# EAGLE board module_special_reg_ctrl (EAGLE 6.5.0)
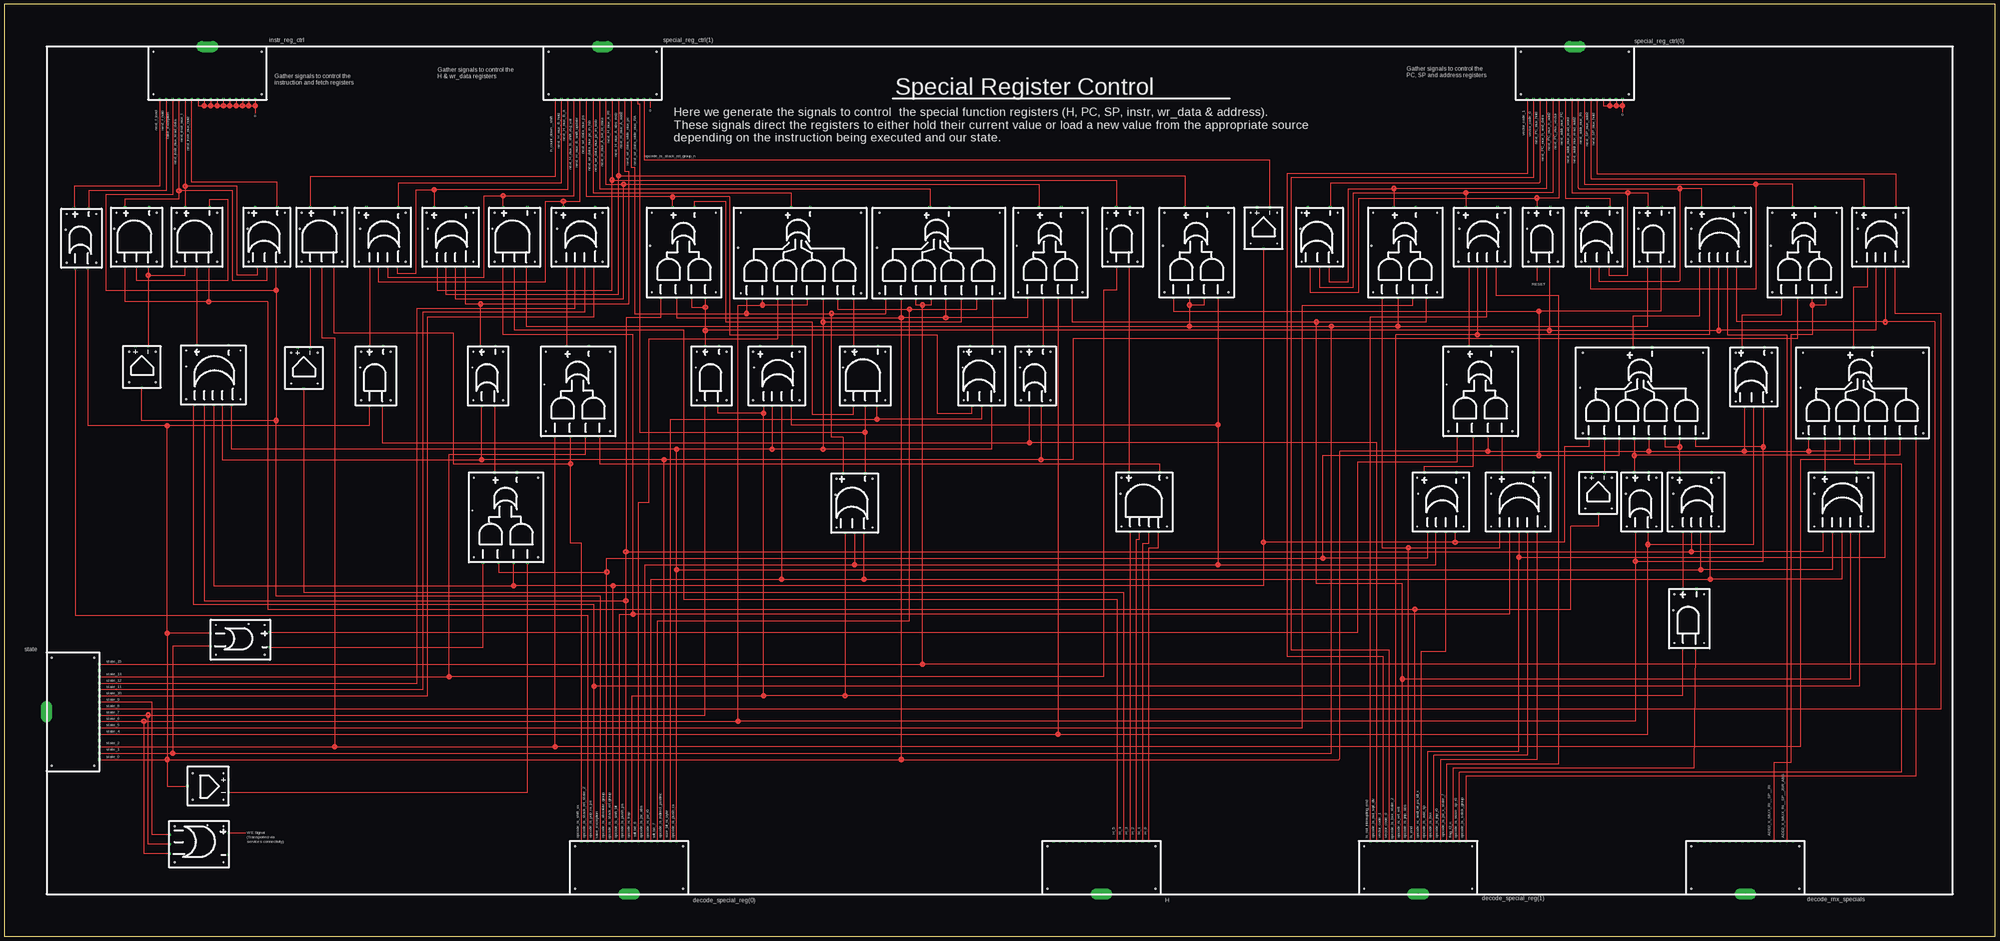
[diagram p12: board, top side]

Size 1193.8 x 558.8 mm. Coordinates in mm from the lower left corner, seen from the top.
Outline: 0,0 1193.8,0 1193.8,558.8 0,558.8 0,0
Copper layers (1*16): Top 0.035mm / dielectric 1.5mm / Bottom 0.035mm
Design rules "default": minimum track width 10mil, minimum drill 24mil, track to track 8mil, track to pad 8mil, pad to pad 8mil, via to via 8mil, smd to smd 8mil, copper to edge 40mil, drill to drill 8mil, minimum pad ring 10mil, minimum via ring 8mil, stop-mask expansion 4mil, vias tented up to drill 0mil, thermal gap 10mil
tKeepout: area 16.3,16.3 to 34.5,34.5; area 587.8,524.3 to 606,542.5; area 1159.3,524.3 to 1177.5,542.5; area 587.8,16.3 to 606,34.5; area 1159.3,16.3 to 1177.5,34.5; area 16.3,524.3 to 34.5,542.5

## Footprints (pad centres in the part's own frame; a part is rotated, then mirrored left to right if it is on the bottom)
3OR = drill 0.8 square: OUT_M 16.51,-6.985; OUT_P 16.51,6.35; P$1 -19.05,-6.35; P$2 -19.05,-0.635; P$3 -19.05,5.08 | hole 0.6: -15.875,-11.43; 13.335,-11.43; 13.335,10.16; -15.875,10.16; 3.81,10.795
2OR = drill 0.8 square: OUT_M 17.78,-4.445; OUT_P 17.78,4.445; P$1 -17.78,-3.81; P$2 -17.78,3.81 | hole 0.6: -14.605,8.89; 14.605,-8.89; 14.605,8.89; -14.605,-8.89; 5.08,9.525
BUS_SPLIT_DISPLAY = drill 0.8 pad 6.452 long: INPUT 0,15.24 | drill 0.8 square: P$1 -28.575,-16.51; P$2 -24.765,-16.51; P$3 -20.955,-16.51; P$4 -17.145,-16.51; P$5 -13.335,-16.51; P$6 -9.525,-16.51; P$7 -5.715,-16.51; P$8 -1.905,-16.51; P$9 1.905,-16.51; P$10 5.715,-16.51; P$11 9.525,-16.51; P$12 13.335,-16.51; P$13 17.145,-16.51; P$14 20.955,-16.51; P$15 24.765,-16.51; P$16 28.575,-16.51 | hole 0.6: -32.385,-13.335; -32.385,12.065; 32.385,12.065; 32.385,-13.335
1BUF = drill 0.8 square: IN -12.7,0; N 12.065,-3.81; P 12.065,3.81 | hole 0.6: -9.525,7.62; -9.525,-8.255; 8.89,-8.255; 8.89,7.62
4OR = drill 0.8 square: 1 -16.51,-8.255; 2 -16.51,-2.54; 3 -16.51,3.175; 4 -16.51,8.255; OUT_M 19.05,-8.89; OUT_P 19.05,10.16 | hole 0.6: -13.335,-13.335; 15.875,-13.335; 15.875,14.605; -13.335,14.605; 6.35,13.97
4X2AND_OR = drill 0.8 square: OUT_M 26.67,-6.985; OUT_P 26.67,4.445; P$1 -27.94,-33.02; P$2 -27.94,-23.495; P$3 -27.94,-14.605; P$4 -27.94,-5.08; P$5 -27.94,3.81; P$6 -27.94,12.7; P$7 -27.94,21.59; P$8 -27.94,31.115 | hole 0.6: -24.765,-37.465; 23.495,-37.465; 23.495,34.608; -24.765,34.608; 2.54,36.195
5OR = drill 0.8 square: 1 -17.78,-10.795; 2 -17.78,-5.08; 3 -17.78,0; 4 -17.78,5.715; 5 -17.78,11.43; OUT_M 17.78,-8.89; OUT_P 17.78,10.16 | hole 0.6: -14.605,-15.875; 14.605,-15.875; 14.605,16.51; -14.605,16.51; 5.08,16.51
3AND = drill 0.8 square: OUT_M 16.51,-7.62; OUT_P 16.51,6.985; P$1 -19.05,-6.985; P$2 -19.05,0; P$3 -19.05,6.985 | hole 0.6: -15.875,-12.065; 13.335,-12.065; 13.335,12.065; -15.875,12.065; 3.81,13.335
2AND = drill 0.8 square: OUT_M 19.05,-4.445; OUT_P 19.05,3.81; P$1 -16.51,-3.81; P$2 -16.51,3.81 | hole 0.6: -13.335,8.89; 15.875,-8.89; -13.335,-8.89; 15.875,8.89; 6.35,9.525
2X2AND_OR = drill 0.8 square: OUT_M 27.94,-6.985; OUT_P 27.94,6.35; P$1 -26.035,-13.335; P$2 -26.035,-5.08; P$3 -26.035,3.81; P$4 -26.035,13.335 | hole 0.6: -22.86,18.733; 24.765,18.733; -22.86,-19.685; 24.765,-19.685; 5.08,19.685
4AND = drill 0.8 square: OUT_M 17.145,-8.89; OUT_P 17.145,9.525; P$1 -18.415,-8.255; P$2 -18.415,-2.54; P$3 -18.415,3.175; P$4 -18.415,8.89 | hole 0.6: -15.24,-13.335; 13.97,-13.335; 13.97,13.97; -15.24,13.97; 4.445,14.605

## Placement (x,y rotation side)
CMP1  3OR  [3OR]  955.67,420.37 90 top
CMP2  2OR  [2OR]  618.49,335.92 90 top
CMP3  BUS_CONSTRUCT_DISPLAY  [BUS_SPLIT_DISPLAY]  358.77,518.16 0 top
CMP4  1BUF  [1BUF]  122.56,90.17 0 top
CMP5  4OR  [4OR]  861.7,259.08 90 top
CMP6  1BUF  [1BUF]  179.71,341 90 top
CMP7  1BUF  [1BUF]  755.01,424.81 90 top
CMP8  2OR  [2OR]  290.19,335.92 90 top
CMP9  4OR  [4OR]  1014.73,259.08 90 top
CMP10  4X2AND_OR  [4X2AND_OR]  981.08,326.39 90 top
CMP11  5OR  [5OR]  1028.07,419.1 90 top
CMP12  2OR  [2OR]  141.6,177.8 0 top
CMP13  BUS_SPLIT_DISPLAY  [BUS_SPLIT_DISPLAY]  1043.94,40.64 180 top
CMP14  3OR  [3OR]  509.27,260.99 90 top
CMP15  3AND  [3AND]  190.5,420.37 90 top
CMP16  2AND  [2AND]  989.33,417.83 90 top
CMP17  2X2AND_OR  [2X2AND_OR]  407.04,408.94 90 top
CMP18  BUS_SPLIT_DISPLAY  [BUS_SPLIT_DISPLAY]  40.64,134.62 90 top
CMP19  BUS_SPLIT_DISPLAY  [BUS_SPLIT_DISPLAY]  657.86,40.64 180 top
CMP20  2X2AND_OR  [2X2AND_OR]  1078.87,408.94 90 top
CMP21  3AND  [3AND]  516.25,337.19 90 top
CMP22  1BUF  [1BUF]  955.67,266.06 90 top
CMP23  BUS_SPLIT_DISPLAY  [BUS_SPLIT_DISPLAY]  847.73,40.64 180 top
CMP24  BUS_SPLIT_DISPLAY  [BUS_SPLIT_DISPLAY]  374.65,40.64 180 top
CMP25  4OR  [4OR]  463.55,334.64 90 top
CMP26  4X2AND_OR  [4X2AND_OR]  476.25,410.21 90 top
CMP27  3OR  [3OR]  585.47,337.19 90 top
CMP28  4X2AND_OR  [4X2AND_OR]  559.43,410.21 90 top
CMP29  5OR  [5OR]  908.05,260.35 90 top
CMP30  4OR  [4OR]  886.46,417.83 90 top
CMP31  BUS_CONSTRUCT_DISPLAY  [BUS_SPLIT_DISPLAY]  121.92,518.16 0 top
CMP32  4AND  [4AND]  683.89,260.99 90 top
CMP33  2AND  [2AND]  670.56,417.83 90 top
CMP34  2X2AND_OR  [2X2AND_OR]  714.38,408.94 90 top
CMP35  3AND  [3AND]  306.07,420.37 90 top
CMP36  3OR  [3OR]  1048.38,336.55 90 top
CMP37  2X2AND_OR  [2X2AND_OR]  626.75,408.94 90 top
CMP38  4OR  [4OR]  267.97,417.83 90 top
CMP39  2X2AND_OR  [2X2AND_OR]  343.54,325.75 90 top
CMP40  4OR  [4OR]  345.44,417.83 90 top
CMP41  5OR  [5OR]  1101.72,260.35 90 top
CMP42  4X2AND_OR  [4X2AND_OR]  1113.15,326.39 90 top
CMP43  2OR  [2OR]  981.71,260.35 90 top
CMP44  2X2AND_OR  [2X2AND_OR]  884.55,325.75 90 top
CMP45  2AND  [2AND]  424.18,334.64 90 top
CMP46  2X2AND_OR  [2X2AND_OR]  300.36,250.19 90 top
CMP47  4OR  [4OR]  1125.22,417.83 90 top
CMP48  2AND  [2AND]  222.88,334.64 90 top
CMP49  4OR  [4OR]  227.33,417.83 90 top
CMP50  3OR  [3OR]  118.11,55.88 0 top
CMP52  2X2AND_OR  [2X2AND_OR]  839.47,408.94 90 top
CMP53  2AND  [2AND]  922.65,417.83 90 top
CMP54  3OR  [3OR]  788.03,420.37 90 top
CMP56  BUS_CONSTRUCT_DISPLAY  [BUS_SPLIT_DISPLAY]  941.71,518.16 0 top
CMP57  2OR  [2OR]  46.35,418.46 90 top
CMP58  5OR  [5OR]  125.73,336.55 90 top
CMP59  3AND  [3AND]  115.57,420.37 90 top
CMP60  3AND  [3AND]  79.38,420.37 90 top
CMP61  3OR  [3OR]  156.84,420.37 90 top
CMP62  1BUF  [1BUF]  82.55,341.63 90 top
CMP67  2AND  [2AND]  1010.28,189.23 90 top

## Tracks (layer width: path | path; a pad name or v marks a point on that pad's centre or on a via)
ADD2_X_MUX_RI__SP__JSR_ABS
  Top 0.61: CMP11.2 1033.14,360.68 1068.7,360.68 CMP13.P$2
FLAG_F2_N
  Top 0.61: CMP67.P$1 1013.46,100.97 868.68,100.97 CMP23.P$3
H_0
  Top 0.61: CMP19.P$1 686.43,233.04 692.15,233.04 CMP32.P$1
H_1
  Top 0.61: CMP19.P$2 682.62,235.59 686.43,235.59 CMP32.P$2
H_2
  Top 0.61: CMP19.P$3 678.82,238.12 680.72,238.12 CMP32.P$3
H_3
  Top 0.61: CMP32.P$4 CMP19.P$4
H_4
  Top 0.61: CMP6.IN 179.71,206.38 671.2,206.38 CMP19.P$5
H_4_N
  Top 0.61: CMP15.P$3 CMP6.N
H_5
  Top 0.61: CMP19.P$6 667.38,201.93 407.67,201.93 407.67,363.22 306.07,363.22 CMP35.P$2
H_COUNT_DOWN_SHIFT
  Top 0.61: CMP3.P$1 330.2,455.3 183.51,455.3 CMP15.OUT_P
H_COUNT_IS_15
  Top 0.61: CMP33.P$1 CMP32.OUT_P
H_COUNT_IS_15_N
  Top 0.61: CMP39.P$1 356.87,283.21 692.78,283.21 CMP32.OUT_M
IS_END
  Top 0.61: 122.56,380.37 158.12,380.37 158.12,196.22 845.82,196.22 | 122.56,380.37 72.39,380.37 CMP60.P$3 | CMP22.IN 955.67,245.75 939.16,245.75 939.16,196.22 845.82,196.22 | CMP59.P$1 122.56,380.37 | CMP23.P$9 845.82,196.22
IS_END_N
  Top 0.61: CMP10.P$7 CMP22.N
IS_NOT_INTERRUPTING_END
  Top 0.61: CMP23.P$16 819.15,371.48 889,371.48 CMP30.2
IS_STATE_0_1
  Top 0.61: CMP12.OUT_P 811.53,182.25 811.53,284.48 871.22,284.48 CMP44.P$4
IS_STATE_0_1_N
  Top 0.61: CMP12.OUT_M 287.02,173.35 CMP46.P$4
IS_STATE_0_4_6
  Top 0.61: CMP36.OUT_P 1042.04,372.75 1065.53,372.75 CMP20.P$4
IS_STATE_4_6
  Top 0.61: CMP10.P$5 977.26,288.29 | 977.26,288.29 CMP43.OUT_P | CMP42.P$2 1136.65,288.29 977.26,288.29
N$1
  Top 0.61: CMP56.P$13 958.85,497.84 962.66,497.84 | 962.66,497.84 966.47,497.84 | 966.47,497.84 970.28,497.84 | 970.28,497.84 970.28,494.03 | CMP56.P$16 970.28,497.84 | CMP56.P$15 966.47,497.84 | CMP56.P$14 962.66,497.84
N$4
  Top 0.61: CMP31.P$16 150.5,497.84 | 150.5,497.84 150.5,493.39 | CMP31.P$7 116.2,497.84 120.02,497.84 | 120.02,497.84 123.83,497.84 | 123.83,497.84 127.64,497.84 | 127.64,497.84 131.44,497.84 | 131.44,497.84 135.25,497.84 | 135.25,497.84 139.06,497.84 | 139.06,497.84 142.88,497.84 | 142.88,497.84 146.69,497.84 | 146.69,497.84 150.5,497.84 | CMP31.P$8 120.02,497.84 | CMP31.P$9 123.83,497.84 | CMP31.P$10 127.64,497.84 | CMP31.P$11 131.44,497.84 | CMP31.P$12 135.25,497.84 | CMP31.P$13 139.06,497.84 | CMP31.P$14 142.88,497.84 | CMP31.P$15 146.69,497.84
N$5
  Top 0.61: 387.35,500.38 387.35,496.57
NEXT_ADDR_MUX_ADD2
  Top 0.61: CMP11.OUT_P 1017.9,448.31 1004.57,448.31 | 1004.57,448.31 1004.57,393.06 1003.93,392.43 956.31,392.43 CMP1.P$2 | CMP56.P$9 943.61,448.94 944.25,448.31 1004.57,448.31
NEXT_ADDR_MUX_ADD2__SET_A
  Top 0.61: CMP10.OUT_P 976.63,372.11 1016.63,372.11 CMP11.5
NEXT_ADDR_MUX_ADD2__SET_A_OPTIONS
  Top 0.61: CMP10.P$3 995.68,293.37 1004.57,293.37 | 1004.57,293.37 CMP10.P$2 | CMP9.OUT_P 1004.57,293.37
NEXT_ADDR_MUX_PC
  Top 0.61: CMP56.P$7 935.99,442.6 962.66,442.6 CMP1.OUT_M
NEXT_ADDR_MUX_READ_WORD
  Top 0.61: CMP56.P$8 939.8,445.77 973.46,445.77 | 973.46,445.77 985.52,445.77 CMP16.OUT_P | CMP1.P$1 962.02,396.24 973.46,396.24 973.46,445.77
NEXT_ADDR_MUX_RI
  Top 0.61: CMP20.OUT_P 1072.52,450.85 1050.29,450.85 | 1050.29,450.85 1050.29,387.99 951.23,387.99 951.23,400.69 CMP1.P$3 | CMP56.P$10 947.42,450.85 1050.29,450.85
NEXT_ADDR_MUX_RI__SP
  Top 0.61: CMP20.P$1 1092.2,378.46 1083.94,378.46 | 1083.94,378.46 CMP20.P$2 | 1083.94,378.46 1083.94,360.68 1071.24,360.68 1071.24,104.14 1061.09,104.14 CMP13.P$4
NEXT_F_HOLD
  Top 0.61: CMP31.P$2 97.16,447.04 50.8,447.04 CMP57.OUT_M
NEXT_F_LOAD
  Top 0.61: CMP31.P$1 93.34,449.58 41.91,449.58 CMP57.OUT_P
NEXT_H_MUX_A_ABS_MSB
  Top 0.61: CMP3.P$11 368.3,455.93 | 368.3,455.93 708.02,455.93 CMP34.OUT_P | CMP38.3 264.8,384.81 368.3,384.81 368.3,455.93
NEXT_H_MUX_A_ADD2
  Top 0.61: CMP3.P$12 372.11,458.47 374.65,458.47 374.65,379.1 285.75,379.1 | CMP38.1 276.23,379.1 285.75,379.1 | CMP8.OUT_P 285.75,379.1
NEXT_H_MUX_A_ADD2__SET_A
  Top 0.61: CMP8.P$1 CMP46.OUT_P
NEXT_H_MUX_A_R1
  Top 0.61: CMP3.P$10 364.49,453.39 | 364.49,453.39 666.75,453.39 CMP33.OUT_P | CMP38.4 259.71,387.35 364.49,387.35 364.49,453.39
NEXT_H_MUX_A_SXT_RD_DATA
  Top 0.61: CMP3.P$9 360.68,450.85 371.48,450.85 | 371.48,450.85 620.39,450.85 CMP37.OUT_P | CMP38.2 270.51,382.27 371.48,382.27 371.48,450.85
NEXT_H_MUX_A_SXT_RD_DATA__EXCL_N
  Top 0.61: CMP37.P$3 CMP2.OUT_M
NEXT_H_MUX_B_A
  Top 0.61: CMP3.P$3 337.82,447.68 257.81,447.68 | 257.81,447.68 CMP38.OUT_P | CMP49.1 235.59,397.51 247.01,397.51 247.01,447.68 257.81,447.68
NEXT_H_MUX_B_CLEAR
  Top 0.61: CMP49.4 CMP48.OUT_P
NEXT_H_MUX_B_HOLD
  Top 0.61: CMP3.P$2 334.01,451.49 236.22,451.49 CMP49.OUT_M
NEXT_H_MUX_B_SHIFT_REG_VAL
  Top 0.61: CMP35.OUT_P 299.08,443.87 | 299.08,443.87 341.63,443.87 CMP3.P$4 | CMP49.2 229.87,394.97 287.65,394.97 287.65,443.87 299.08,443.87
NEXT_H_MUX_B_SHIFT_UPDATE
  Top 0.61: CMP40.OUT_P 335.28,440.69 | 335.28,440.69 345.44,440.69 CMP3.P$5 | CMP49.3 224.16,392.43 324.49,392.43 324.49,440.69 335.28,440.69
NEXT_H_MUX_B_SHIFT_UPDATE__SET_A
  Top 0.61: CMP40.4 CMP39.OUT_P
NEXT_INSTR_MUX_F
  Top 0.61: CMP31.P$5 108.58,449.58 | 108.58,449.58 CMP59.OUT_P | CMP61.P$3 151.76,396.24 139.7,396.24 139.7,449.58 108.58,449.58
NEXT_INSTR_MUX_F__OPTIONS
  Top 0.61: CMP59.P$2 CMP58.OUT_P
NEXT_INSTR_MUX_F_N
  Top 0.61: CMP59.OUT_M 123.19,441.96 133.99,441.96 133.99,393.06 79.38,393.06 CMP60.P$2
NEXT_INSTR_MUX_HOLD
  Top 0.61: CMP61.OUT_M 163.83,452.12 112.39,452.12 CMP31.P$6
NEXT_INSTR_MUX_READ_DATA
  Top 0.61: CMP31.P$4 104.78,447.04 | 104.78,447.04 104.78,441.96 72.39,441.96 CMP60.OUT_P | CMP61.P$2 157.48,393.06 137.16,393.06 137.16,447.04 104.78,447.04
NEXT_PC_MUX_ADD2
  Top 0.61: CMP56.P$5 928.37,445.77 876.3,445.77 | 876.3,445.77 CMP30.OUT_P | CMP54.P$2 788.67,389.25 808.99,389.25 808.99,445.77 876.3,445.77
NEXT_PC_MUX_ADD2__0_OPTIONS
  Top 0.61: CMP44.P$1 CMP29.OUT_P
NEXT_PC_MUX_ADD2__MEM_OPTIONS
  Top 0.61: CMP5.OUT_P 851.53,281.94 880.75,281.94 CMP44.P$3
NEXT_PC_MUX_ADD2__SET_A
  Top 0.61: CMP30.4 CMP44.OUT_P
NEXT_PC_MUX_H_AND_DATA
  Top 0.61: CMP56.P$4 924.56,448.31 833.12,448.31 | 833.12,448.31 CMP52.OUT_P | CMP54.P$1 794.38,392.43 805.82,392.43 805.82,448.31 833.12,448.31
NEXT_PC_MUX_HOLD
  Top 0.61: CMP56.P$3 920.75,452.12 920.12,451.49 795.02,451.49 CMP54.OUT_M
NEXT_PC_MUX_VECTOR
  Top 0.61: CMP56.P$6 932.18,442.6 918.85,442.6 | 918.85,442.6 CMP53.OUT_P | CMP54.P$3 782.96,386.08 812.16,386.08 812.16,442.6 918.85,442.6
NEXT_SP_ADD2__B
  Top 0.61: CMP47.4 1116.96,389.25 1108.71,389.25 CMP42.OUT_P
NEXT_SP_MUX_ADD2
  Top 0.61: CMP56.P$11 951.23,454.02 1115.06,454.02 CMP47.OUT_P
NEXT_SP_MUX_ADD2__SET_A_OPTIONS
  Top 0.61: CMP42.P$7 CMP41.OUT_P
NEXT_SP_MUX_HOLD
  Top 0.61: CMP56.P$12 955.04,457.2 1134.11,457.2 CMP47.OUT_M
NEXT_WR_DATA_MUX_PC_RA_LSB__7
  Top 0.61: CMP26.P$1 CMP21.OUT_P
NEXT_WR_DATA_MUX_PC_RA_MSB__7
  Top 0.61: CMP28.P$1 CMP27.OUT_M
NEXT_WR_DATA_MUX_PC_RN_LSB
  Top 0.61: CMP3.P$7 353.06,445.77 471.81,445.77 CMP26.OUT_P
NEXT_WR_DATA_MUX_PC_RN_MSB
  Top 0.61: CMP3.P$8 356.87,448.31 554.99,448.31 CMP28.OUT_P
NEXT_WR_DATA_MUX_PS
  Top 0.61: 400.69,443.23 434.98,443.23 434.98,360.68 559.43,360.68 559.43,313.69 580.39,313.69 CMP27.P$3 | 400.69,443.23 349.25,443.23 CMP3.P$6 | CMP17.OUT_P 400.69,443.23
NEXT_WR_DATA_MUX_PS_N
  Top 0.61: CMP17.OUT_M 414.02,440.69 432.44,440.69 432.44,368.3 484.5,368.3 484.5,313.06 509.27,313.06 CMP21.P$3
NON_RESET_TRAP
  Top 0.61: CMP9.4 CMP67.OUT_P
OPCODE_IS_ABSOLUTE_GROUP
  Top 0.61: CMP16.P$1 993.14,374.65 920.12,374.65 | 920.12,374.65 920.12,288.29 | 920.12,288.29 968.38,288.29 CMP10.P$6 | CMP34.P$4 701.04,374.65 920.12,374.65 | CMP5.4 853.44,226.69 790.58,226.69 | 790.58,226.69 790.58,288.29 920.12,288.29 | CMP46.P$3 296.55,218.44 361.31,218.44 | 790.58,226.69 361.31,226.69 361.31,218.44 | CMP24.P$12 361.31,218.44
OPCODE_IS_ADD_SP
  Top 0.61: CMP29.3 908.05,227.33 | 908.05,227.33 1127.76,227.33 CMP42.P$3 | 908.05,227.33 908.05,111.12 853.44,111.12 CMP23.P$7
OPCODE_IS_ANDI_ORI_PS_LDI_X
  Top 0.61: CMP5.2 864.24,170.81 849.63,170.81 CMP23.P$8
OPCODE_IS_BXX
  Top 0.61: CMP29.2 913.13,108.58 857.25,108.58 CMP23.P$6
OPCODE_IS_BXX_STATE_2
  Top 0.61: CMP30.3 883.28,360.68 | 883.28,360.68 834.39,360.68 CMP23.P$12 | CMP11.4 1022.35,360.68 883.28,360.68
OPCODE_IS_INDIRECT_POSTINC
  Top 0.61: CMP58.2 130.81,285.75 286.38,285.75 | 286.38,285.75 CMP8.P$2 | CMP20.P$3 1075.06,358.14 640.72,358.14 640.72,285.75 621.66,285.75 | CMP2.P$1 621.66,317.5 621.66,285.75 | 621.66,285.75 395.61,285.75 | 395.61,285.75 286.38,285.75 | CMP24.P$3 395.61,285.75
OPCODE_IS_JMP_ABS
  Top 0.61: CMP52.P$4 826.13,233.04 842.01,233.04 | 842.01,233.04 896.62,233.04 CMP29.5 | CMP23.P$10 842.01,233.04
OPCODE_IS_JMP_R0
  Top 0.61: CMP29.1 918.85,106.05 861.06,106.05 CMP23.P$5
OPCODE_IS_JSR_ABS
  Top 0.61: CMP34.P$1 727.71,306.7 | 727.71,306.7 727.71,222.88 | 727.71,222.88 858.52,222.88 CMP5.3 | CMP25.1 471.81,306.7 727.71,306.7 | CMP14.P$2 509.9,222.88 | 509.9,222.88 727.71,222.88 | CMP24.P$6 384.18,222.88 509.9,222.88
OPCODE_IS_JSR_R0
  Top 0.61: CMP41.3 1101.72,214 1022.99,214 | 1022.99,214 CMP9.1 | CMP25.2 466.09,214 | 466.09,214 515.62,214 | 515.62,214 CMP14.P$1 | 515.62,214 1022.99,214 | CMP24.P$5 387.99,214 466.09,214
OPCODE_IS_JSR_X_STATE_7
  Top 0.61: CMP30.1 894.72,384.18 932.18,384.18 932.18,103.5 864.87,103.5 CMP23.P$4
OPCODE_IS_MOVE_SP_R0
  Top 0.61: CMP42.P$5 1109.35,283.21 1137.29,283.21 1137.29,98.42 872.49,98.42 CMP23.P$2
OPCODE_IS_MUL_SQRT_DIV
  Top 0.61: 614.68,295.91 822.96,295.91 CMP23.P$15 | 614.68,295.91 CMP2.P$2 | CMP48.P$1 226.69,295.91 614.68,295.91
OPCODE_IS_POP_RA_PS
  Top 0.61: CMP24.P$14 353.69,149.86 | 353.69,149.86 353.69,198.75 113.67,198.75 113.67,318.13 CMP58.5 | CMP41.1 1112.52,149.86 353.69,149.86
OPCODE_IS_PUSH_PS
  Top 0.61: CMP17.P$4 393.7,370.84 372.75,370.84 372.75,230.5 | CMP41.5 1090.3,230.5 1011.55,230.5 | CMP9.3 1011.55,230.5 | 372.75,230.5 1011.55,230.5 | CMP24.P$9 372.75,201.29 | 372.75,201.29 372.75,230.5 | CMP58.4 120.02,201.29 372.75,201.29
OPCODE_IS_PUSH_RA
  Top 0.61: CMP25.3 460.38,292.1 | 460.38,292.1 403.23,292.1 | 403.23,292.1 136.53,292.1 CMP58.1 | CMP26.P$3 490.86,368.3 | 490.86,368.3 574.04,368.3 CMP28.P$3 | CMP41.4 1096.01,219.71 1017.27,219.71 | 1017.27,219.71 CMP9.2 | 490.86,368.3 490.86,292.1 | 490.86,292.1 460.38,292.1 | CMP27.P$1 591.82,292.1 490.86,292.1 | 403.23,219.71 1017.27,219.71 | CMP24.P$1 403.23,219.71 | 403.23,219.71 403.23,292.1
OPCODE_IS_RET_RETI
  Top 0.61: CMP37.P$1 640.08,368.3 786.76,368.3 | 786.76,368.3 852.8,368.3 CMP52.P$1 | 786.76,368.3 786.76,211.46 838.2,211.46 838.2,154.31 | CMP23.P$11 838.2,154.31 | CMP41.2 1106.81,154.31 838.2,154.31
OPCODE_IS_SHIFT_BIT
  Top 0.61: CMP29.4 902.34,193.04 377.19,193.04 | 377.19,193.04 377.19,360.68 299.08,360.68 CMP35.P$3 | CMP24.P$10 368.94,193.04 377.19,193.04
OPCODE_IS_SHIFT_XX
  Top 0.61: CMP15.P$1 197.49,361.95 269.24,361.95 269.24,283.21 339.73,283.21 | 339.73,283.21 CMP39.P$3 | CMP24.P$16 346.07,235.59 339.73,235.59 339.73,283.21
OPCODE_IS_STACK_GROUP
  Top 0.61: CMP42.P$1 1146.17,95.89 876.3,95.89 CMP23.P$1
OPCODE_IS_STACK_REL_GROUP
  Top 0.61: CMP10.P$8 949.96,293.37 935.36,293.37 935.36,236.22 869.95,236.22 | 869.95,236.22 CMP5.1 | CMP7.IN 755.01,236.22 | 755.01,236.22 755.01,210.19 365.12,210.19 | 365.12,210.19 305.44,210.19 | 305.44,210.19 CMP46.P$2 | CMP58.3 125.73,210.19 305.44,210.19 | CMP24.P$11 365.12,210.19 | 869.95,236.22 755.01,236.22
OPCODE_IS_STACK_REL_GROUP_N
  Top 0.61: CMP7.N 758.83,465.45 383.54,465.45 CMP3.P$15
OPCODE_IS_STACK_REL_STATE_2
  Top 0.61: CMP57.P$2 42.55,192.41 349.88,192.41 CMP24.P$15
OPCODE_IS_TRAP
  Top 0.61: CMP25.4 455.3,313.69 | 455.3,313.69 427.99,313.69 CMP45.P$1 | CMP14.P$3 504.19,144.15 | 504.19,144.15 455.3,144.15 | 455.3,144.15 455.3,313.69 | CMP67.P$2 1006.48,144.15 504.19,144.15 | CMP24.P$8 376.56,144.15 455.3,144.15
OPCODE_IS_TRAP_JSR_X
  Top 0.61: CMP28.P$8 528.32,373.38 495.94,373.38 | CMP14.OUT_P 502.92,299.08 495.94,299.08 495.94,373.38 | CMP26.P$8 445.13,373.38 | 445.13,373.38 495.94,373.38 | CMP3.P$13 375.92,461.01 377.82,461.01 377.82,373.38 445.13,373.38
OPCODE_IS_TRAP_JSR_X_N
  Top 0.61: CMP21.P$2 516.25,302.26 | 516.25,302.26 CMP14.OUT_M | CMP3.P$14 379.73,499.11 381,499.11 381,302.26 516.25,302.26
OPCODE_IS_TRAP_JSR_X_PUSH_RA_N
  Top 0.61: CMP26.P$5 CMP25.OUT_M
RESET_SIGNAL
  Top 0.61: CMP53.P$2 918.85,393.06
SIZE_BIT_IS_BYTE
  Top 0.61: CMP27.P$2 586.11,309.88 523.24,309.88 | 523.24,309.88 CMP21.P$1 | CMP24.P$2 399.42,309.88 523.24,309.88
STATE_0
  Top 0.61: CMP36.P$3 1043.31,290.83 | 1043.31,290.83 1082.04,290.83 | 1082.04,290.83 CMP42.P$8 | CMP10.P$4 986.15,290.83 | 986.15,290.83 1043.31,290.83 | CMP44.P$2 889.63,290.83 | 889.63,290.83 986.15,290.83 | 889.63,290.83 800.74,290.83 800.74,106.68 800.1,106.05 537.85,106.05 | CMP17.P$3 403.23,370.84 537.85,370.84 | CMP28.P$7 537.85,370.84 | CMP42.P$6 1100.45,290.83 1082.04,290.83 | CMP57.P$1 50.16,306.07 97.79,306.07 | CMP48.P$2 219.07,306.07 97.79,306.07 | CMP18.P$1 97.79,106.05 | 97.79,106.05 537.85,106.05 | CMP37.P$4 613.41,370.84 564.51,370.84 | 564.51,370.84 537.85,370.84 | CMP12.P$2 97.79,181.61 | 97.79,181.61 97.79,106.05 | 97.79,106.05 97.79,90.17 CMP4.IN | 97.79,181.61 97.79,306.07 | 537.85,370.84 537.85,106.05 | CMP28.P$4 564.51,370.84
STATE_0_N
  Top 0.61: CMP4.N 313.69,86.36 CMP46.P$1
STATE_1
  Top 0.61: CMP35.P$1 313.06,365.76 710.57,365.76 | 710.57,365.76 795.65,365.76 | 795.65,365.76 835.66,365.76 | 835.66,365.76 985.52,365.76 CMP16.P$2 | CMP52.P$3 835.66,365.76 | CMP34.P$3 710.57,378.46 | 710.57,378.46 710.57,365.76 | CMP34.P$2 719.46,378.46 710.57,378.46 | 795.65,365.76 795.65,109.86 100.97,109.86 | CMP18.P$2 100.97,109.86 | CMP12.P$1 100.97,173.99 100.97,109.86
STATE_2
  Top 0.61: CMP15.P$2 190.5,358.77 198.12,358.77 198.12,113.67 | CMP18.P$3 198.12,113.67 | 198.12,113.67 330.2,113.67 | 330.2,113.67 CMP39.P$4 | CMP42.P$4 1118.23,285.75 1076.96,285.75 1076.96,113.67 330.2,113.67
STATE_4
  Top 0.61: CMP43.P$1 985.52,234.95 | 985.52,234.95 1049.02,234.95 CMP36.P$2 | CMP18.P$5 631.83,121.28 | 631.83,121.28 985.52,121.28 985.52,234.95 | CMP37.P$2 631.83,121.28
STATE_5
  Top 0.61: CMP18.P$6 778.51,125.09 778.51,378.46 844.55,378.46 CMP52.P$2
STATE_6
  Top 0.61: CMP36.P$1 1054.73,293.37 | 1054.73,293.37 1014.1,293.37 CMP10.P$1 | 977.9,224.79 1054.73,224.79 1054.73,293.37 | CMP26.P$4 481.33,378.46 454.66,378.46 | 454.66,378.46 CMP26.P$7 | CMP18.P$7 83.82,128.91 | 83.82,128.91 440.06,128.91 | 440.06,128.91 440.06,378.46 454.66,378.46 | 977.9,224.79 977.9,128.91 440.06,128.91 | CMP43.P$2 977.9,224.79 | CMP50.P$1 83.82,49.53 83.82,128.91
STATE_7
  Top 0.61: CMP18.P$8 86.36,132.72 | 86.36,132.72 420.37,132.72 CMP45.P$2 | CMP50.P$2 86.36,55.24 86.36,132.72
STATE_8
  Top 0.61: CMP47.1 1133.47,373.38 1161.41,373.38 1161.41,136.53 CMP18.P$9
STATE_9
  Top 0.61: CMP50.P$3 88.9,60.96 88.9,140.34 CMP18.P$10
STATE_10
  Top 0.61: CMP18.P$11 254,144.15 254,371.48 353.69,371.48 CMP40.1
STATE_11
  Top 0.61: CMP40.2 347.98,374.01 250.82,374.01 250.82,147.96 CMP18.P$12
STATE_12
  Top 0.61: CMP18.P$13 247.65,151.76 247.65,376.56 342.26,376.56 CMP40.3
STATE_13
  Top 0.61: CMP18.P$14 266.7,155.57 | 266.7,155.57 266.7,288.93 348.62,288.93 CMP39.P$2 | CMP33.P$2 666.75,387.35 659.13,387.35 659.13,155.57 266.7,155.57
STATE_15
  Top 0.61: 1127.76,368.3 1157.61,368.3 1157.61,163.19 550.54,163.19 | 1127.76,368.3 1038.86,368.3 CMP11.1 | CMP18.P$16 550.54,163.19 | 550.54,163.19 550.54,378.46 | 550.54,378.46 546.74,378.46 CMP28.P$6 | CMP28.P$5 555.62,378.46 550.54,378.46 | CMP47.2 1127.76,368.3
TAKE_EXCEPTION
  Top 0.61: CMP31.P$3 100.97,444.5 60.96,444.5 60.96,387.35 163.19,387.35 | 163.19,387.35 CMP61.P$1 | 163.19,387.35 163.19,309.25 | 163.19,309.25 82.55,309.25 CMP62.IN | CMP24.P$13 357.5,203.84 163.19,203.84 163.19,309.25
TAKE_EXCEPTION_N
  Top 0.61: CMP60.P$1 86.36,396.24 | 86.36,396.24 108.58,396.24 CMP59.P$3 | 86.36,396.24 CMP62.N
TRAP_STATE_7
  Top 0.61: CMP47.3 1122.05,363.22 1028.07,363.22 | 1028.07,363.22 CMP11.3 | CMP17.P$1 420.37,377.19 | 420.37,377.19 420.37,363.22 | 420.37,363.22 CMP45.OUT_P | CMP17.P$2 412.12,377.19 420.37,377.19 | CMP53.P$1 926.47,363.22 | 926.47,363.22 1028.07,363.22 | 926.47,363.22 420.37,363.22
VECTOR_CODE_0
  Top 0.61: CMP56.P$2 916.94,454.66 771.52,454.66 771.52,171.45 830.58,171.45 CMP23.P$13
VECTOR_CODE_1
  Top 0.61: CMP56.P$1 913.13,457.2 768.99,457.2 768.99,167.64 826.77,167.64 CMP23.P$14
WE
  Top 0.61: CMP50.OUT_P 144.78,62.23
WILL_BE_STATE_6
  Top 0.61: CMP26.P$6 463.55,358.14 386.71,358.14 386.71,260.35 380.37,260.35 CMP24.P$7
WILL_BE_STATE_7
  Top 0.61: CMP28.P$2 582.93,375.92 542.92,375.92 | CMP26.P$2 499.75,375.92 542.92,375.92 | CMP24.P$4 391.8,189.23 542.92,189.23 542.92,375.92
(copper drawn outside any net)
  shapes: Top circle x112

## Text on the board
tPlace: instr_reg_ctrl | special_reg_ctrl(1) | special_reg_ctrl(0) | Gather signals to control the / PC, SP and address registers | Gather signals to control the / H & wr_data registers | Gather signals to control the / instruction and fetch registers | Special Register Control | 0 | 0 | 0 | next_f_load | next_f_hold | vector_code_1 | vector_code_0 | take_exception | next_H_mux_B_A | next_instr_mux_f | next_H_mux_A_RI | Here we generate the signals to control the special function registers (H, PC, SP, instr, wr_data & address). / These signals direct the registers to either hold their current value or load a new value from the appropriate source / depending on the instruction being executed and our state. | next_PC_mux_hold | next_addr_mux_RI | next_addr_mux_PC | next_SP_mux_add2 | next_SP_mux_hold | next_H_mux_B_hold | next_H_mux_A_add2 | next_PC_mux_vector | next_instr_mux_hold | h_count_down__shift | next_PC_mux_h_add2 | next_wr_data_mux_ps | next_H_mux_A_abs_msb | opcode_is_stack_rel_group_n | next_PC_mux_h_and_data | next_addr_mux_read_word | next_addr_mux_read_add2 | next_instr_mux_read_data | next_H_mux_A_sxt_rd_data | next_wr_data_wide_mux_pc | next_wr_data_wide_mux_RA | next_H_mux_B_shift_update | next_H_mux_B_shift_reg_val | next_wr_data_mux_pc_rn_lsb | next_wr_data_mux_pc_rn_msb | RESET | state | state_15 | state_13 | state_12 | state_11 | state_10 | state_9 | state_8 | state_7 | state_6 | state_5 | state_4 | state_2 | state_1 | state_0 | H_5 | H_4 | H_3 | H_2 | H_1 | H_0 | will_be_6 | opcode_is_jst_x_state_7 | ADD2_X_MUX_RI__SP__RI | opcode_is_shift_xx | opcode_is_stack_rel_state_2 | opcode_is_pop_ra_ps | take_exception | opcode_is_absolute_group | opcode_is_shift_bit | opcode_is_push_ps | opcode_is_trap | opcode_is_jsr_abs | opcode_is_jsr_r0 | will_be_7 | opcode_is_indirect_postinc | size_bit_is_byte | opcode_is_push_ra | is_not_interrupting_end | opcode_is_mul_sqrt_div | vector_code_1 | vector_code_0 | opcode_is_ret_reti | opcode_is_jmp_abs | is_end | opcode_is_andi_ori_ps_ldi_x | opcode_is_add_sp | opcode_is_bxx | opcode_is_jmp_r0 | flag_f2_n | opcode_is_move_sp_r0 | opcode_is_satck_group | ADD2_X_MUX_RI__SP__JSR_ABS | opcode_is_stack_rel_group | opcode_is_bxx_state_2 | WE Signal / (Transported via / services connectivity) | decode_special_reg(1) | decode_rnx_specials | decode_special_reg(0) | H